# Altium schematic sheet F28335.SchDoc
size A3
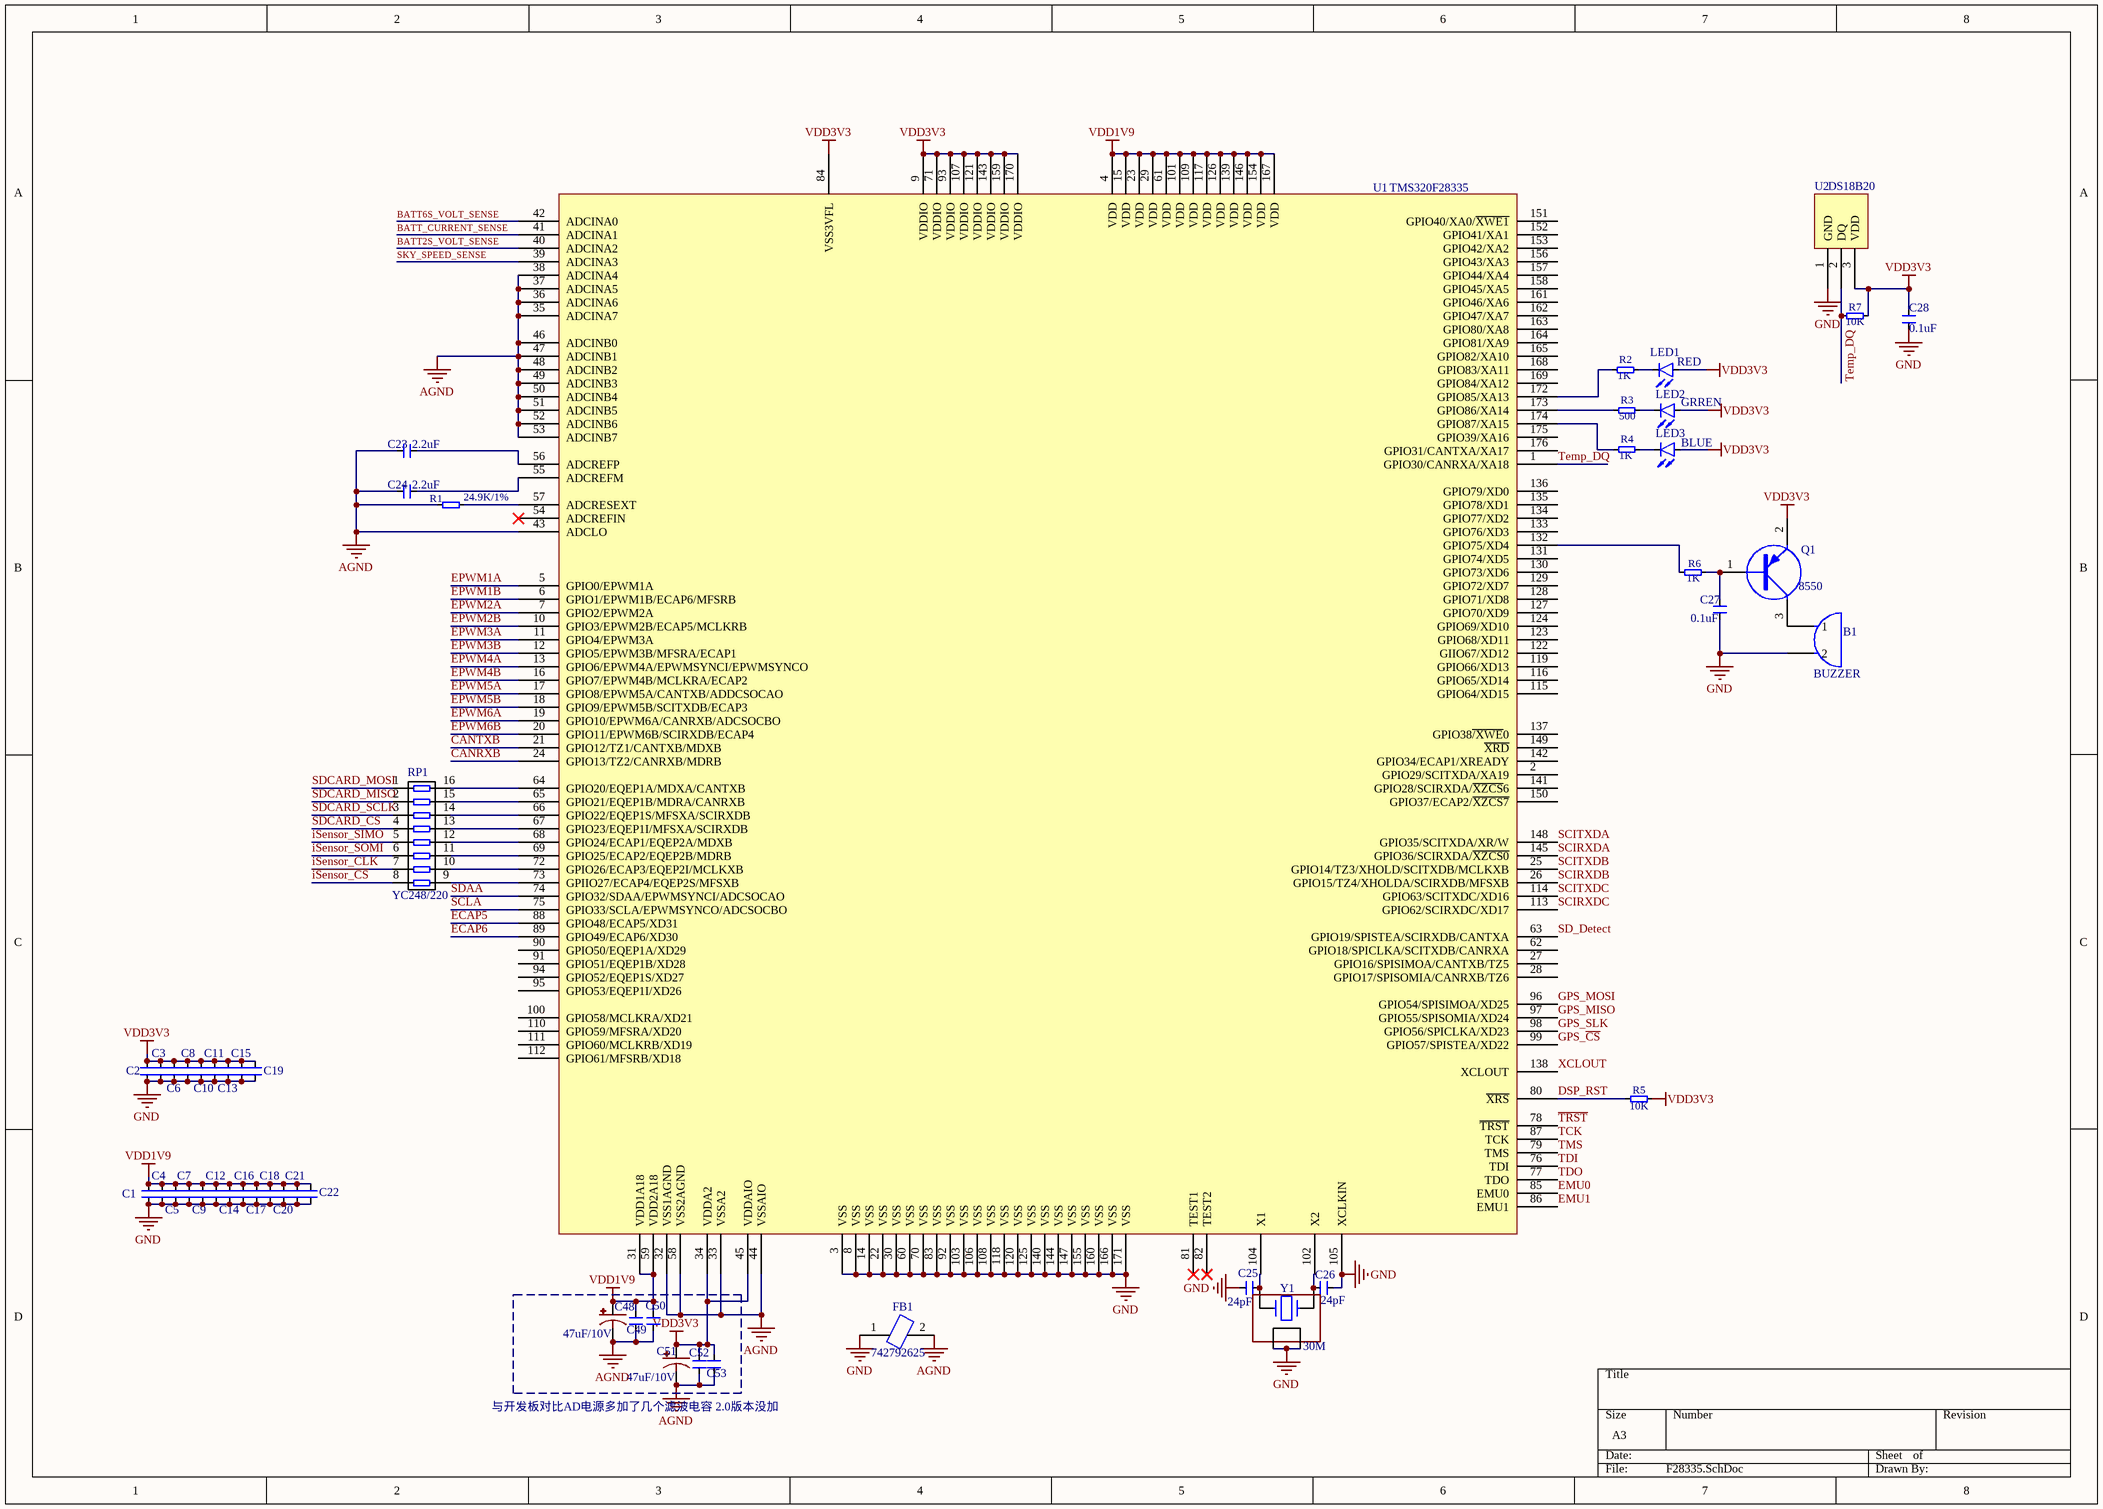
[diagram p0: F28335.SchDoc]

## Parts
B1  BUZZER  [SMD-Beep(9.6*9.6)]
C1  0.1uF  [0603C]  (value not drawn)
C2  0.1uF  [0603C]  (value not drawn)
C3  0.1uF  [0603C]  (value not drawn)
C4  0.1uF  [0603C]  (value not drawn)
C5  0.1uF  [0603C]  (value not drawn)
C6  0.1uF  [0603C]  (value not drawn)
C7  0.1uF  [0603C]  (value not drawn)
C8  0.1uF  [0603C]  (value not drawn)
C9  0.1uF  [0603C]  (value not drawn)
C10  0.1uF  [0603C]  (value not drawn)
C11  0.1uF  [0603C]  (value not drawn)
C12  0.1uF  [0603C]  (value not drawn)
C13  0.1uF  [0603C]  (value not drawn)
C14  0.1uF  [0603C]  (value not drawn)
C15  0.1uF  [0603C]  (value not drawn)
C16  0.1uF  [0603C]  (value not drawn)
C17  0.1uF  [0603C]  (value not drawn)
C18  0.1uF  [0603C]  (value not drawn)
C19  0.1uF  [0603C]  (value not drawn)
C20  0.1uF  [0603C]  (value not drawn)
C21  0.1uF  [0603C]  (value not drawn)
C22  0.1uF  [0603C]  (value not drawn)
C23  2.2uF  [0603C]
C24  2.2uF  [0603C]
C25  24pF  [0603C]
C26  24pF  [0603C]
C27  0.1uF  [0603C]
C28  0.1uF  [0603C]
C48  47uF/10V  [3216/A]
C49  0.1uF  [0603C]  (value not drawn)
C50  0.1uF  [0603C]  (value not drawn)
C51  47uF/10V  [3216/A]
C52  0.1uF  [0603C]  (value not drawn)
C53  0.1uF  [0603C]  (value not drawn)
FB1  742792625  [0603-FB]
LED1  RED  [0603D]
LED2  GRREN  [0603D]
LED3  BLUE  [0603D]
Q1  8550  [SOT23-PNP]
R1  24.9K/1%  [0603R]
R2  1K  [0603R]
R3  500  [0603R]
R4  1K  [0603R]
R5  10K  [0603R]
R6  1K  [0603R]
R7  10K  [0603R]
RP1  YC248/220  [YC248(0603x8)]
U1  TMS320F28335  [LQFP-176]
U2  DS18B20  [TO-92]
Y1  30M  [5032Y]

## Nets
AGND: C23.2 C24.2 C48.2 C49.2 C50.2 C51.2 C52.2 C53.2 FB1.2 R1.1 U1.32(VSS1AGND) U1.33(VSSA2) U1.35(ADCINA7) U1.36(ADCINA6) U1.37(ADCINA5) U1.38(ADCINA4) U1.43(ADCLO) U1.44(VSSAIO) U1.46(ADCINB0) U1.47(ADCINB1) U1.48(ADCINB2) U1.49(ADCINB3) U1.50(ADCINB4) U1.51(ADCINB5) U1.52(ADCINB6) U1.53(ADCINB7) U1.58(VSS2AGND)
GND: B1.2 C1.2 C2.2 C3.2 C4.2 C5.2 C6.2 C7.2 C8.2 C9.2 C10.2 C11.2 C12.2 C13.2 C14.2 C15.2 C16.2 C17.2 C18.2 C19.2 C20.2 C21.2 C22.2 C25.2 C26.1 C27.1 C28.1 FB1.1 U1.3(VSS) U1.8(VSS) U1.14(VSS) U1.22(VSS) U1.30(VSS) U1.60(VSS) U1.70(VSS) U1.83(VSS) U1.92(VSS) U1.103(VSS) U1.105(XCLKIN) U1.106(VSS) U1.108(VSS) U1.118(VSS) U1.120(VSS) U1.125(VSS) U1.140(VSS) U1.144(VSS) U1.147(VSS) U1.155(VSS) U1.160(VSS) U1.166(VSS) U1.171(VSS) U2.1(GND) Y1.2 Y1.4
VDD1V9: C1.1 C4.1 C5.1 C7.1 C9.1 C12.1 C14.1 C16.1 C17.1 C18.1 C20.1 C21.1 C22.1 C48.1 C49.1 C50.1 U1.4(VDD) U1.15(VDD) U1.23(VDD) U1.29(VDD) U1.31(VDD1A18) U1.59(VDD2A18) U1.61(VDD) U1.101(VDD) U1.109(VDD) U1.117(VDD) U1.126(VDD) U1.139(VDD) U1.146(VDD) U1.154(VDD) U1.167(VDD)
VDD3V3: C2.1 C3.1 C6.1 C8.1 C10.1 C11.1 C13.1 C15.1 C19.1 C28.2 C51.1 C52.1 C53.1 LED1.1 LED2.1 LED3.1 Q1.2(E) R5.2 R7.1 U1.9(VDDIO) U1.34(VDDA2) U1.45(VDDAIO) U1.71(VDDIO) U1.84(VSS3VFL) U1.93(VDDIO) U1.107(VDDIO) U1.121(VDDIO) U1.143(VDDIO) U1.159(VDDIO) U1.170(VDDIO) U2.3(VDD)
BATT2S_VOLT_SENSE: U1.40(ADCINA2)
BATT6S_VOLT_SENSE: U1.42(ADCINA0)
BATT_CURRENT_SENSE: U1.41(ADCINA1)
CANRXB: U1.24(GPIO13/TZ2/CANRXB/MDRB)
CANTXB: U1.21(GPIO12/TZ1/CANTXB/MDXB)
DSP_RST: R5.1 U1.80(~{XRS})
ECAP5: U1.88(GPIO48/ECAP5/XD31)
ECAP6: U1.89(GPIO49/ECAP6/XD30)
EMU0: U1.85(EMU0)
EMU1: U1.86(EMU1)
EPWM1A: U1.5(GPIO0/EPWM1A)
EPWM1B: U1.6(GPIO1/EPWM1B/ECAP6/MFSRB)
EPWM2A: U1.7(GPIO2/EPWM2A)
EPWM2B: U1.10(GPIO3/EPWM2B/ECAP5/MCLKRB)
EPWM3A: U1.11(GPIO4/EPWM3A)
EPWM3B: U1.12(GPIO5/EPWM3B/MFSRA/ECAP1)
EPWM4A: U1.13(GPIO6/EPWM4A/EPWMSYNCI/EPWMSYNCO)
EPWM4B: U1.16(GPIO7/EPWM4B/MCLKRA/ECAP2)
EPWM5A: U1.17(GPIO8/EPWM5A/CANTXB/ADDCSOCAO)
EPWM5B: U1.18(GPIO9/EPWM5B/SCITXDB/ECAP3)
EPWM6A: U1.19(GPIO10/EPWM6A/CANRXB/ADCSOCBO)
EPWM6B: U1.20(GPIO11/EPWM6B/SCIRXDB/ECAP4)
GPS_~{CS}: U1.99(GPIO57/SPISTEA/XD22)
GPS_MISO: U1.97(GPIO55/SPISOMIA/XD24)
GPS_MOSI: U1.96(GPIO54/SPISIMOA/XD25)
GPS_SLK: U1.98(GPIO56/SPICLKA/XD23)
~{iSensor_CS}: RP1.8
iSensor_CLK: RP1.7
iSensor_SIMO: RP1.5
iSensor_SOMI: RP1.6
SCIRXDA: U1.145(GPIO36/SCIRXDA/~{XZCS0})
SCIRXDB: U1.26(GPIO15/TZ4/XHOLDA/SCIRXDB/MFSXB)
SCIRXDC: U1.113(GPIO62/SCIRXDC/XD17)
SCITXDA: U1.148(GPIO35/SCITXDA/XR/W)
SCITXDB: U1.25(GPIO14/TZ3/XHOLD/SCITXDB/MCLKXB)
SCITXDC: U1.114(GPIO63/SCITXDC/XD16)
SCLA: U1.75(GPIO33/SCLA/EPWMSYNCO/ADCSOCBO)
SD_Detect: U1.63(GPIO19/SPISTEA/SCIRXDB/CANTXA)
SDAA: U1.74(GPIO32/SDAA/EPWMSYNCI/ADCSOCAO)
SDCARD_CS: RP1.4
SDCARD_MISO: RP1.2
SDCARD_MOSI: RP1.1
SDCARD_SCLK: RP1.3
SKY_SPEED_SENSE: U1.39(ADCINA3)
~{TRST}: U1.78(~{TRST})
TCK: U1.87(TCK)
TDI: U1.76(TDI)
TDO: U1.77(TDO)
Temp_DQ: R7.2 U1.1(GPIO30/CANRXA/XA18) U2.2(DQ)
TMS: U1.79(TMS)
XCLOUT: U1.138(XCLOUT)
NetB1_1: B1.1 Q1.3(C)
NetC23_1: C23.1 U1.56(ADCREFP)
NetC24_1: C24.1 U1.55(ADCREFM)
NetC25_1: C25.1 U1.104(X1) Y1.1
NetC26_2: C26.2 U1.102(X2) Y1.3
NetC27_2: C27.2 Q1.1(B) R6.2
NetLED1_2: LED1.2 R2.2
NetLED2_2: LED2.2 R3.2
NetLED3_2: LED3.2 R4.2
NetR1_2: R1.2 U1.57(ADCRESEXT)
NetR2_1: R2.1 U1.172(GPIO85/XA13)
NetR3_1: R3.1 U1.173(GPIO86/XA14)
NetR4_1: R4.1 U1.174(GPIO87/XA15)
NetR6_1: R6.1 U1.132(GPIO75/XD4)
NetRP1_9: RP1.9 U1.73(GPIIO27/ECAP4/EQEP2S/MFSXB)
NetRP1_10: RP1.10 U1.72(GPIO26/ECAP3/EQEP2I/MCLKXB)
NetRP1_11: RP1.11 U1.69(GPIO25/ECAP2/EQEP2B/MDRB)
NetRP1_12: RP1.12 U1.68(GPIO24/ECAP1/EQEP2A/MDXB)
NetRP1_13: RP1.13 U1.67(GPIO23/EQEP1I/MFSXA/SCIRXDB)
NetRP1_14: RP1.14 U1.66(GPIO22/EQEP1S/MFSXA/SCIRXDB)
NetRP1_15: RP1.15 U1.65(GPIO21/EQEP1B/MDRA/CANRXB)
NetRP1_16: RP1.16 U1.64(GPIO20/EQEP1A/MDXA/CANTXB)

Not connected (* = marked no-connect by the designer): U1 2(GPIO29/SCITXDA/XA19) 27(GPIO16/SPISIMOA/CANTXB/TZ5) 28(GPIO17/SPISOMIA/CANRXB/TZ6) 54(ADCREFIN)* 62(GPIO18/SPICLKA/SCITXDB/CANRXA) 81(TEST1)* 82(TEST2)* 90(GPIO50/EQEP1A/XD29) 91(GPIO51/EQEP1B/XD28) 94(GPIO52/EQEP1S/XD27) 95(GPIO53/EQEP1I/XD26) 100(GPIO58/MCLKRA/XD21) 110(GPIO59/MFSRA/XD20) 111(GPIO60/MCLKRB/XD19) 112(GPIO61/MFSRB/XD18) 115(GPIO64/XD15) 116(GPIO65/XD14) 119(GPIO66/XD13) 122(GIIO67/XD12) 123(GPIO68/XD11) 124(GPIO69/XD10) 127(GPIO70/XD9) 128(GPIO71/XD8) 129(GPIO72/XD7) 130(GPIO73/XD6) 131(GPIO74/XD5) 133(GPIO76/XD3) 134(GPIO77/XD2) 135(GPIO78/XD1) 136(GPIO79/XD0) 137(GPIO38~{/XWE}0) 141(GPIO28/SCIRXDA/~{XZCS}6) 142(GPIO34/ECAP1/XREADY) 149(~{XRD}) 150(GPIO37/ECAP2/~{XZCS7}) 151(GPIO40/XA0/~{XWE1}) 152(GPIO41/XA1) 153(GPIO42/XA2) 156(GPIO43/XA3) 157(GPIO44/XA4) 158(GPIO45/XA5) 161(GPIO46/XA6) 162(GPIO47/XA7) 163(GPIO80/XA8) 164(GPIO81/XA9) 165(GPIO82/XA10) 168(GPIO83/XA11) 169(GPIO84/XA12) 175(GPIO39/XA16) 176(GPIO31/CANTXA/XA17)

## Notes on the sheet
- 与开发板对比AD电源多加了几个滤波电容 2.0版本没加

## Library data of the parts
C1-C28 C49 C50 C52 C53 = C
C48 C51 = C-POLAR
FB1 = FB
LED1-LED3 = LED
Q1 = PNP: PNP Transistor
R1-R7 = R
RP1 = RP
Y1 = Crystal-4